# Altium schematic sheet Template_Sch.SchDoc: Template
size A4; CompanyName: BUPT; DrawnBy: BUPT_HCM; Organization: BUPT_Robot; Revision: A; SheetNumber: 1; SheetTotal: 1; Version: 0.0; LibVersion: 0.0
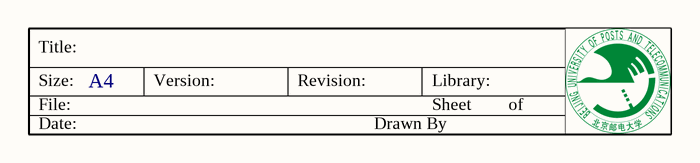
[diagram p0: Template_Sch.SchDoc]

## Notes on the sheet
- Title:
- Size:
- Date:
- File:
- A4
- Version:
- Revision:
- Drawn By
- Sheet
- Library:
- of